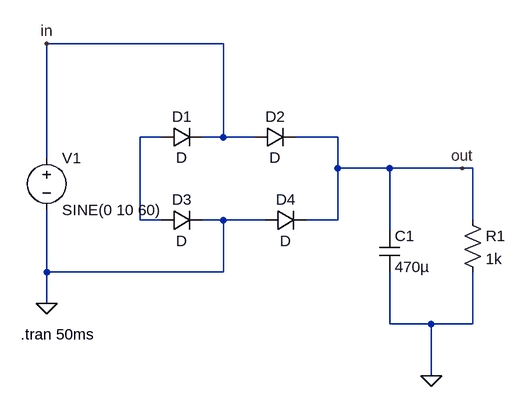
[diagram p0: schematic 3.asc]
3.asc, the LTspice schematic file:
Version 4.1
SHEET 1 880 680
WIRE 336 -64 64 -64
WIRE 240 80 208 80
WIRE 336 80 336 -64
WIRE 336 80 304 80
WIRE 384 80 336 80
WIRE 512 80 448 80
WIRE 64 112 64 -64
WIRE 512 128 512 80
WIRE 592 128 512 128
WIRE 704 128 592 128
WIRE 720 128 704 128
WIRE 208 208 208 80
WIRE 240 208 208 208
WIRE 336 208 304 208
WIRE 400 208 336 208
WIRE 512 208 512 128
WIRE 512 208 464 208
WIRE 720 208 720 128
WIRE 592 224 592 128
WIRE 64 288 64 192
WIRE 336 288 336 208
WIRE 336 288 64 288
WIRE 64 336 64 288
WIRE 592 368 592 288
WIRE 656 368 592 368
WIRE 720 368 720 288
WIRE 720 368 656 368
WIRE 656 448 656 368
FLAG 64 336 0
FLAG 656 448 0
FLAG 64 -64 in
FLAG 704 128 out
SYMBOL voltage 64 96 R0
SYMATTR InstName V1
SYMATTR Value SINE(0 10 60)
SYMBOL diode 240 96 R270
WINDOW 0 32 32 VTop 2
WINDOW 3 0 32 VBottom 2
SYMATTR InstName D1
SYMBOL diode 384 96 R270
WINDOW 0 32 32 VTop 2
WINDOW 3 0 32 VBottom 2
SYMATTR InstName D2
SYMBOL diode 240 224 R270
WINDOW 0 32 32 VTop 2
WINDOW 3 0 32 VBottom 2
SYMATTR InstName D3
SYMBOL diode 400 224 R270
WINDOW 0 32 32 VTop 2
WINDOW 3 0 32 VBottom 2
SYMATTR InstName D4
SYMBOL res 704 192 R0
SYMATTR InstName R1
SYMATTR Value 1k
SYMBOL cap 576 224 R0
SYMATTR InstName C1
SYMATTR Value 470µ
TEXT 24 384 Left 2 !.tran 50ms

The netlist it stands for:
* 3.asc
V1 in 0 SINE(0 10 60)
D1 N001 in D
D2 in out D
D3 N001 0 D
D4 0 out D
R1 out 0 1k
C1 out 0 470µ
.model D D
.lib standard.dio
.tran 50ms
.backanno
.end